# Altium schematic sheet Encoder.SchDoc: Magnetic Encoder
size A4; Date: 2022 Fall; Address1: LK Bulls; Address2: Bagoly Zoltan; Address3: Feher Daniel; Address4: G. Varga Gabor; DocumentNumber: 11; Revision: 1.0; SheetNumber: 11; SheetTotal: 14
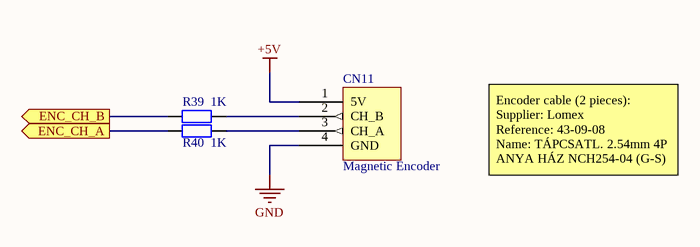
[diagram p0: Encoder.SchDoc]

## Parts
CN11  Magnetic Encoder  [FP_CONN4_TAP_254MM]
R39  1K  [FP_0805_RES]
R40  1K  [FP_0805_RES]

## Ports
ENC_CH_A (out), ENC_CH_B (out)

## Nets
+5V: CN11.1(5V)
GND: CN11.4(GND)
ENC_CH_A: R40.1 ; port ENC_CH_A
ENC_CH_B: R39.1 ; port ENC_CH_B
NetCN11_2: CN11.2(CH_B) R39.2
NetCN11_3: CN11.3(CH_A) R40.2

## Notes on the sheet
- Encoder cable (2 pieces):
  Supplier: Lomex
  Reference: 43-09-08
  Name: TÁPCSATL. 2.54mm 4P ANYA HÁZ NCH254-04 (G-S)
- Title
- Size:
- Date:
- A4
- Number:
- Revision:
- Sheet
- of
- Designed by:
- File:

## Library data of the parts
CN11 = Connector_Encoder: Allegro A1333 Magnetic Encoder; Name: TÁPCSATL. 2.54mm 4P APA 180° NCW254-04S (G-S) FORR.; Supplier: Lomex; Reference: 43-08-97
R39 R40 = RES: Resistor; Tolerance: 5%; Power: 0.125W; Name: 1K00 0805 5% CR-05JL7----1K 0.125W (VIK); Supplier: Lomex; Reference: 81-10-87; Value: 1K